# Altium schematic sheet DSI_and_CSI_Connector.SchDoc
size A3; SheetNumber: 5; SheetTotal: 5
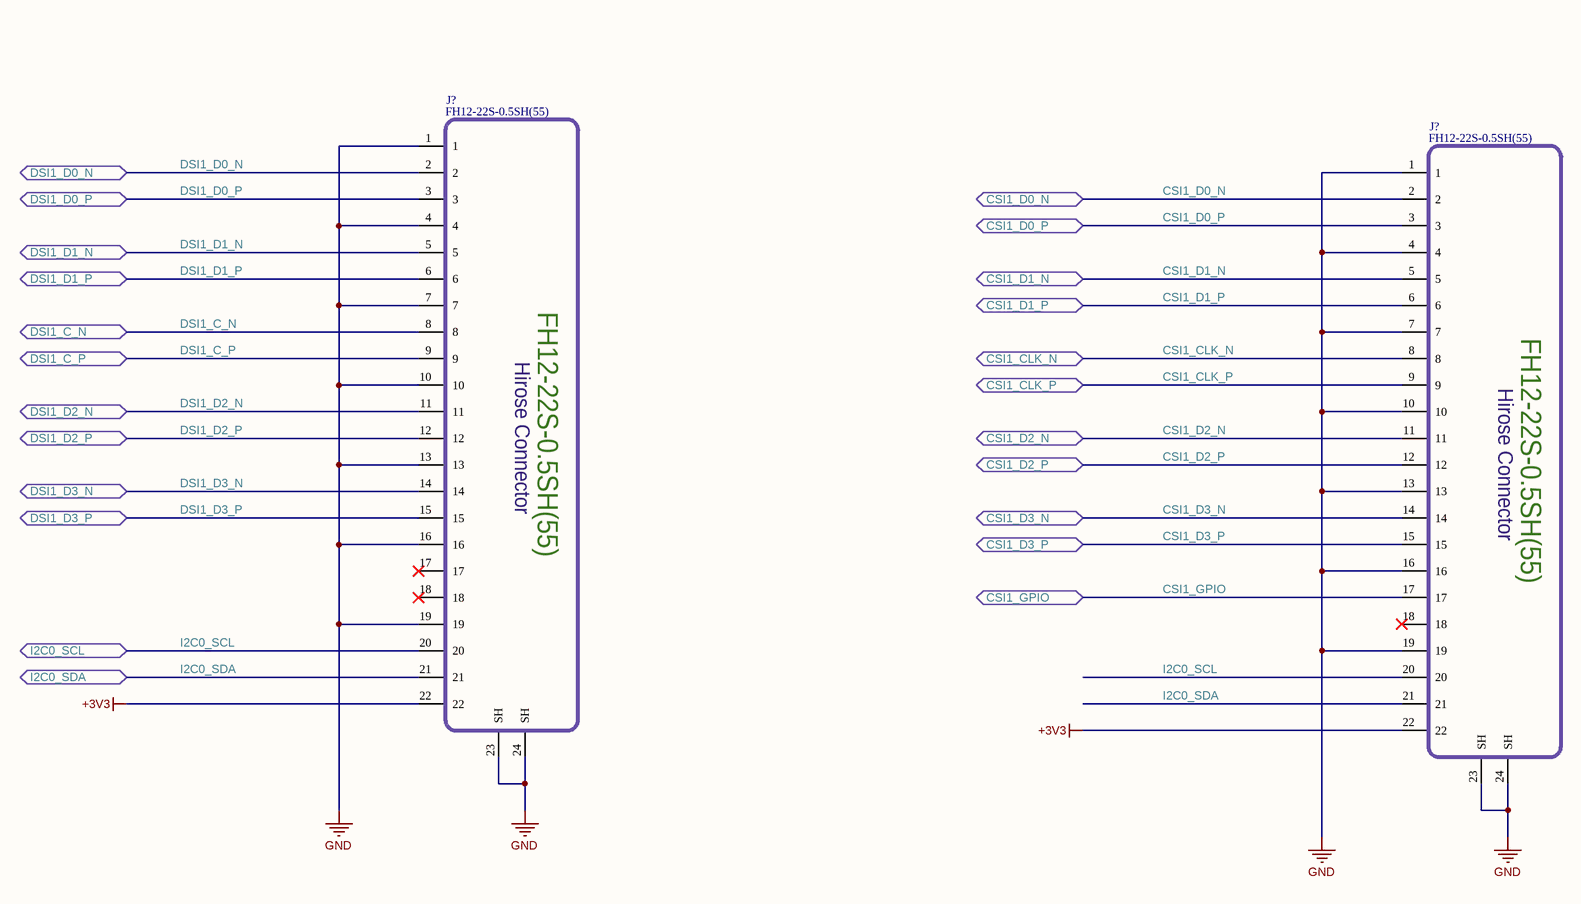
[diagram p0: DSI_and_CSI_Connector.SchDoc]

## Parts
(Parts that share a designator on the sheet are numbered #1, #2 ... from top to bottom, then left to right.)
J?#1  FH12-22S-0.5SH(55)
J?#2  FH12-22S-0.5SH(55)

## Ports
CSI1_CLK_N (bidir), CSI1_CLK_P (bidir), CSI1_D0_N (bidir), CSI1_D0_P (bidir), CSI1_D1_N (bidir), CSI1_D1_P (bidir), CSI1_D2_N (bidir), CSI1_D2_P (bidir), CSI1_D3_N (bidir), CSI1_D3_P (bidir), CSI1_GPIO (bidir), DSI1_C_N (bidir), DSI1_C_P (bidir), DSI1_D0_N (bidir), DSI1_D0_P (bidir), DSI1_D1_N (bidir), DSI1_D1_P (bidir), DSI1_D2_N (bidir), DSI1_D2_P (bidir), DSI1_D3_N (bidir), DSI1_D3_P (bidir), I2C0_SCL (bidir), I2C0_SDA (bidir)

## Nets
+3V3: J?#1.22 J?#2.22
GND: J?#1.1 J?#1.4 J?#1.7 J?#1.10 J?#1.13 J?#1.16 J?#1.19 J?#1.23(SH) J?#1.24(SH) J?#2.1 J?#2.4 J?#2.7 J?#2.10 J?#2.13 J?#2.16 J?#2.19 J?#2.23(SH) J?#2.24(SH)
CSI1_CLK_N: J?#2.8 ; port CSI1_CLK_N
CSI1_CLK_P: J?#2.9 ; port CSI1_CLK_P
CSI1_D0_N: J?#2.2 ; port CSI1_D0_N
CSI1_D0_P: J?#2.3 ; port CSI1_D0_P
CSI1_D1_N: J?#2.5 ; port CSI1_D1_N
CSI1_D1_P: J?#2.6 ; port CSI1_D1_P
CSI1_D2_N: J?#2.11 ; port CSI1_D2_N
CSI1_D2_P: J?#2.12 ; port CSI1_D2_P
CSI1_D3_N: J?#2.14 ; port CSI1_D3_N
CSI1_D3_P: J?#2.15 ; port CSI1_D3_P
CSI1_GPIO: J?#2.17 ; port CSI1_GPIO
DSI1_C_N: J?#1.8 ; port DSI1_C_N
DSI1_C_P: J?#1.9 ; port DSI1_C_P
DSI1_D0_N: J?#1.2 ; port DSI1_D0_N
DSI1_D0_P: J?#1.3 ; port DSI1_D0_P
DSI1_D1_N: J?#1.5 ; port DSI1_D1_N
DSI1_D1_P: J?#1.6 ; port DSI1_D1_P
DSI1_D2_N: J?#1.11 ; port DSI1_D2_N
DSI1_D2_P: J?#1.12 ; port DSI1_D2_P
DSI1_D3_N: J?#1.14 ; port DSI1_D3_N
DSI1_D3_P: J?#1.15 ; port DSI1_D3_P
I2C0_SCL: J?#1.20 J?#2.20 ; port I2C0_SCL
I2C0_SDA: J?#1.21 J?#2.21 ; port I2C0_SDA

Not connected (* = marked no-connect by the designer): J?#1 17* 18*; J?#2 18*

## Notes on the sheet
- (in symbol FH12-22S-0.5SH(55)) Hirose Connector

## Library data of the parts
J?#1 J?#2 = FH12-22S-0.5SH(55): 22 Position FFC, FPC Connector Contacts, Bottom 0.020" (0.50mm) Surface Mount, Right Angle; Manufacturer: Hirose Electric Co Ltd; MinTemp: -40°C; MaxTemp: 85°C; ManufacturerPartNumber: FH12-22S-0.5SH(55); SupplierPartNumber: HFJ122CT-ND; Supplier: Digikey; PartStatus: Active; Price: 2.00; ComponentLink1Description: SupplierURL; ComponentLink1URL: https://www.digikey.in/en/products/detail/hirose-electric-co-ltd/FH12-22S-0-5SH-55/1110321